# EAGLE design tact-switches2 (EAGLE 7.7.0)
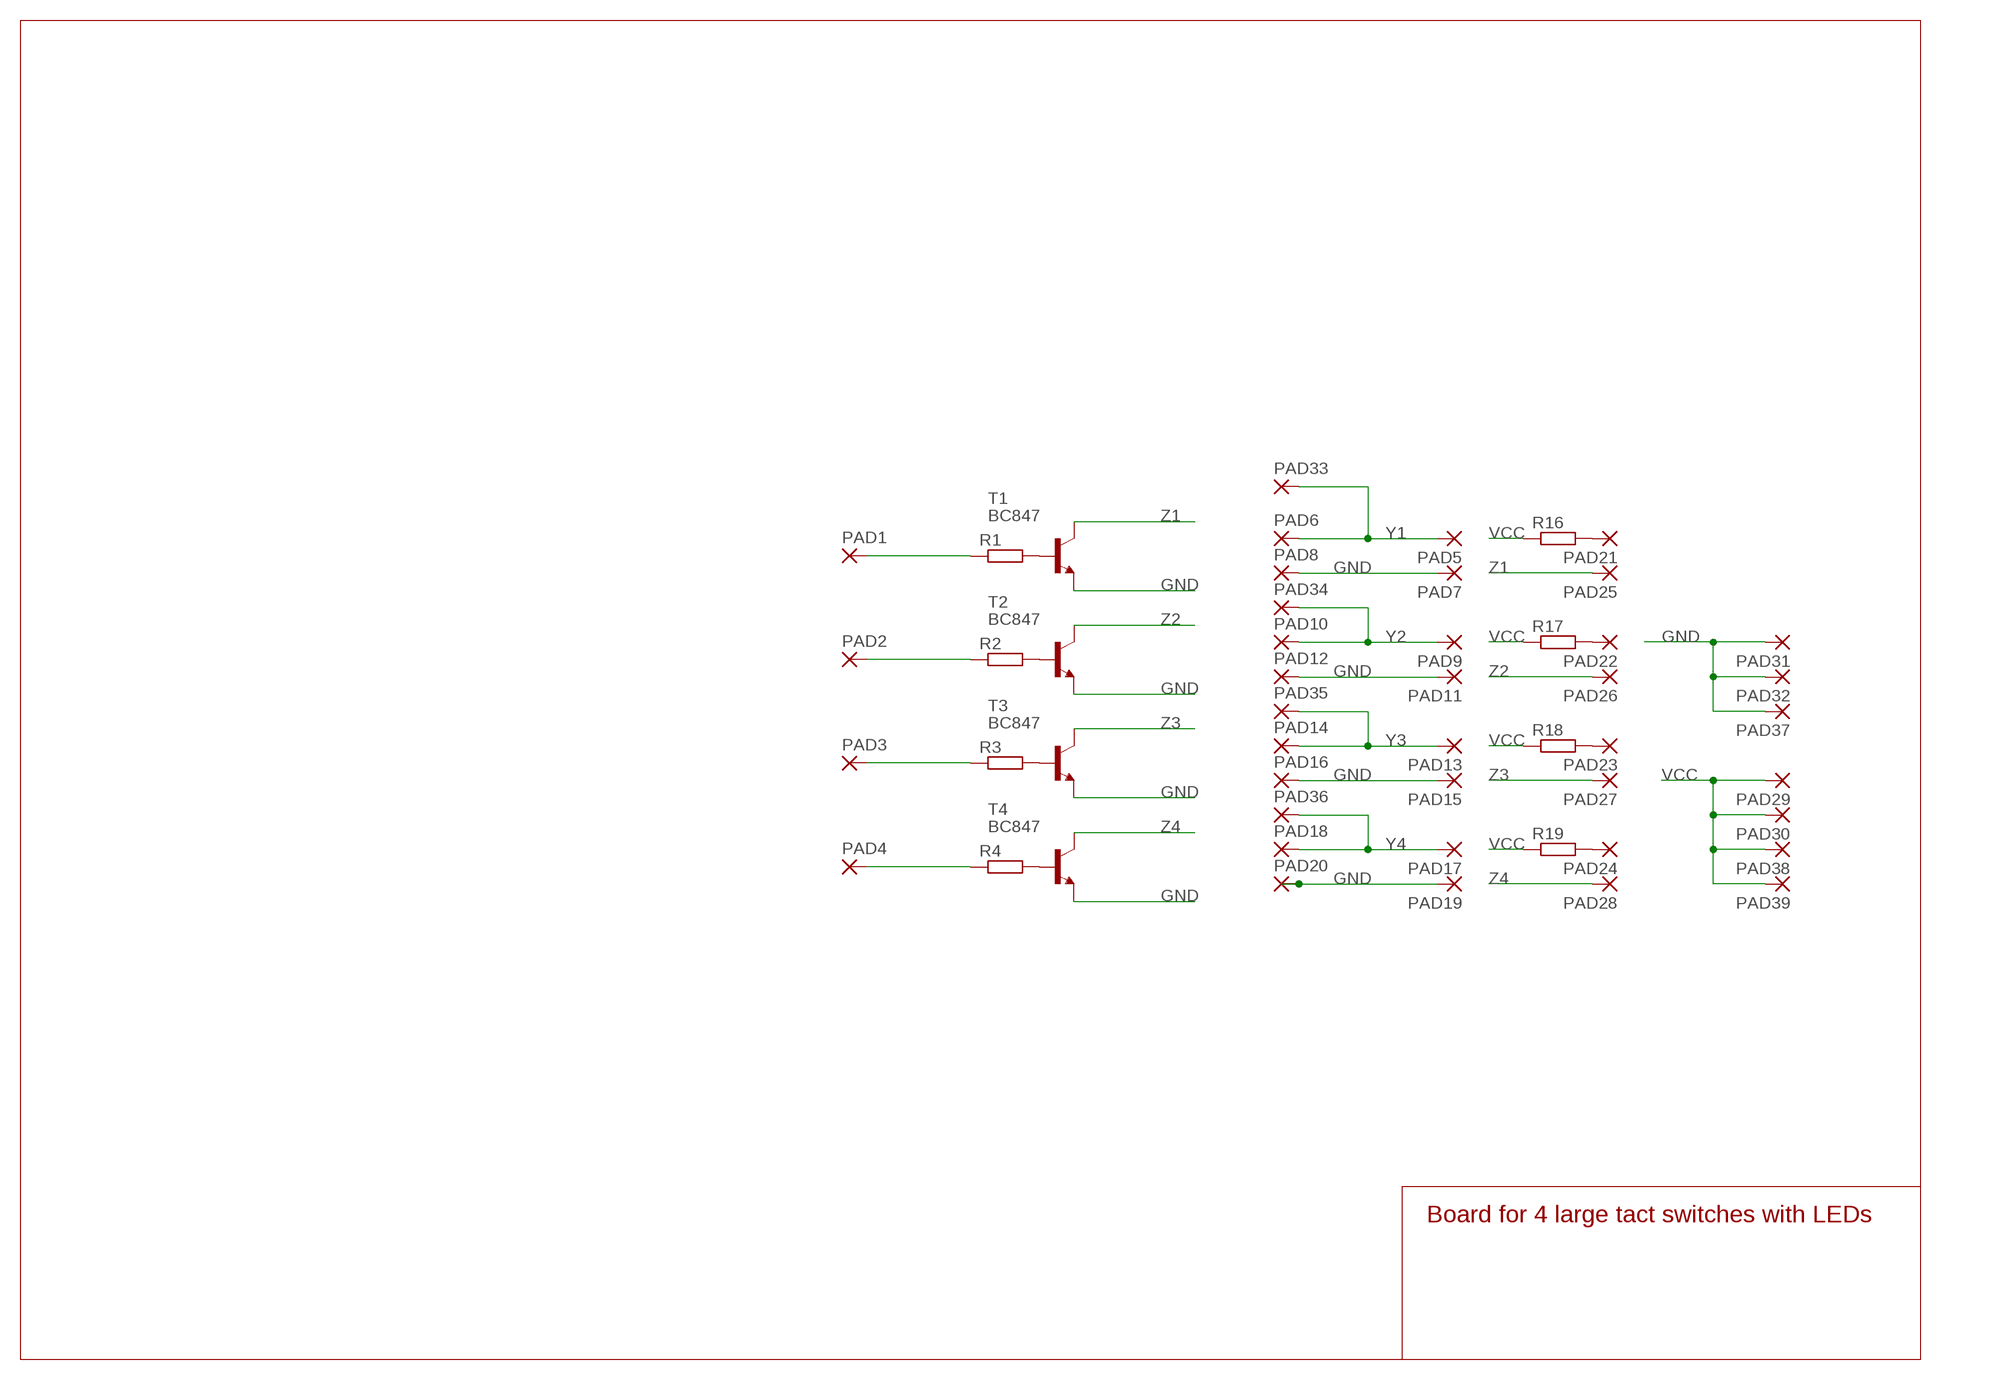
[diagram p0: schematic, sheet 1]

## Parts
PAD1  1,6/0,8  [1,6/0,8]
PAD2  1,6/0,8  [1,6/0,8]
PAD3  1,6/0,8  [1,6/0,8]
PAD4  1,6/0,8  [1,6/0,8]
PAD5  1,6/0,8  [1,6/0,8]
PAD6  1,6/0,8  [1,6/0,8]
PAD7  1,6/0,8  [1,6/0,8]
PAD8  1,6/0,8  [1,6/0,8]
PAD9  1,6/0,8  [1,6/0,8]
PAD10  1,6/0,8  [1,6/0,8]
PAD11  1,6/0,8  [1,6/0,8]
PAD12  1,6/0,8  [1,6/0,8]
PAD13  1,6/0,8  [1,6/0,8]
PAD14  1,6/0,8  [1,6/0,8]
PAD15  1,6/0,8  [1,6/0,8]
PAD16  1,6/0,8  [1,6/0,8]
PAD17  1,6/0,8  [1,6/0,8]
PAD18  1,6/0,8  [1,6/0,8]
PAD19  1,6/0,8  [1,6/0,8]
PAD20  1,6/0,8  [1,6/0,8]
PAD21  1,6/0,8  [1,6/0,8]
PAD22  1,6/0,8  [1,6/0,8]
PAD23  1,6/0,8  [1,6/0,8]
PAD24  1,6/0,8  [1,6/0,8]
PAD25  1,6/0,8  [1,6/0,8]
PAD26  1,6/0,8  [1,6/0,8]
PAD27  1,6/0,8  [1,6/0,8]
PAD28  1,6/0,8  [1,6/0,8]
PAD29  1,6/0,8  [1,6/0,8]
PAD30  1,6/0,8  [1,6/0,8]
PAD31  1,6/0,8  [1,6/0,8]
PAD32  1,6/0,8  [1,6/0,8]
PAD33  1,6/0,8  [1,6/0,8]
PAD34  1,6/0,8  [1,6/0,8]
PAD35  1,6/0,8  [1,6/0,8]
PAD36  1,6/0,8  [1,6/0,8]
PAD37  1,6/0,8  [1,6/0,8]
PAD38  1,6/0,8  [1,6/0,8]
PAD39  1,6/0,8  [1,6/0,8]
R1  R-EU_M0805  [M0805]
R2  R-EU_M0805  [M0805]
R3  R-EU_M0805  [M0805]
R4  R-EU_M0805  [M0805]
R16  R-EU_M0805  [M0805]
R17  R-EU_M0805  [M0805]
R18  R-EU_M0805  [M0805]
R19  R-EU_M0805  [M0805]
T1  BC847  [SOT23]
T2  BC847  [SOT23]
T3  BC847  [SOT23]
T4  BC847  [SOT23]

## Nets
GND: PAD7.1(P) PAD8.1(P) PAD11.1(P) PAD12.1(P) PAD15.1(P) PAD16.1(P) PAD19.1(P) PAD20.1(P) PAD31.1(P) PAD32.1(P) PAD37.1(P) T1.2(E) T2.2(E) T3.2(E) T4.2(E)
N$1: R1.2 T1.1(B)
N$2: R2.2 T2.1(B)
N$3: R3.2 T3.1(B)
N$4: R4.2 T4.1(B)
N$5: PAD1.1(P) R1.1
N$6: PAD2.1(P) R2.1
N$7: PAD3.1(P) R3.1
N$8: PAD4.1(P) R4.1
N$27: PAD21.1(P) R16.2
N$33: PAD22.1(P) R17.2
N$34: PAD23.1(P) R18.2
N$35: PAD24.1(P) R19.2
VCC: PAD29.1(P) PAD30.1(P) PAD38.1(P) PAD39.1(P) R16.1 R17.1 R18.1 R19.1
Y1: PAD5.1(P) PAD6.1(P) PAD33.1(P)
Y2: PAD9.1(P) PAD10.1(P) PAD34.1(P)
Y3: PAD13.1(P) PAD14.1(P) PAD35.1(P)
Y4: PAD17.1(P) PAD18.1(P) PAD36.1(P)
Z1: PAD25.1(P) T1.3(C)
Z2: PAD26.1(P) T2.3(C)
Z3: PAD27.1(P) T3.3(C)
Z4: PAD28.1(P) T4.3(C)

## Notes on the sheet
- Board for 4 large tact switches with LEDs

## Library data of the parts
PAD1-PAD39 = wirepad:1,6/0,8: THROUGH-HOLE PAD
R1-R4 R16-R19 = rcl:R-EU_: RESISTOR, European symbol
T1-T4 = transistor:BC847: NPN TRANSISTOR

## Board
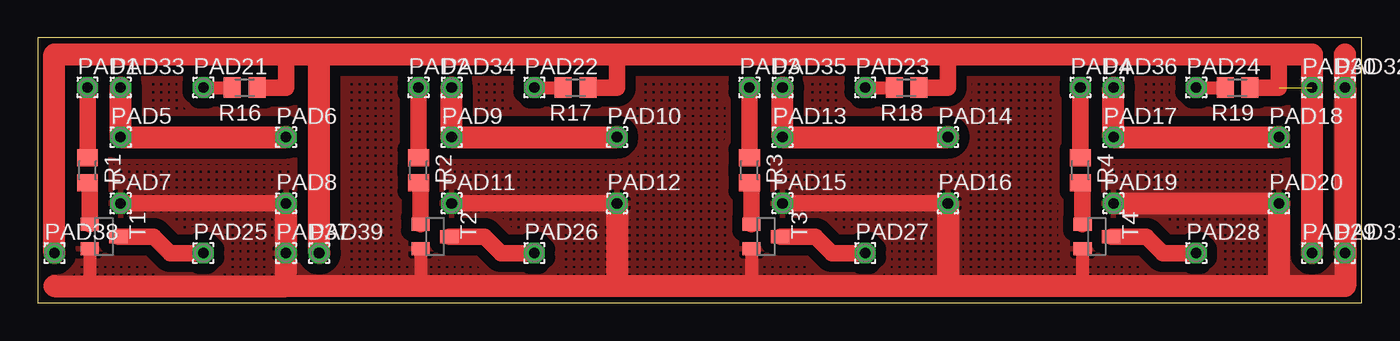
[diagram p1: board, top side]

Size 101.6 x 20.32 mm. Coordinates in mm from the lower left corner, seen from the top.
Outline: 0,0 101.6,0 101.6,20.32 0,20.32 0,0
Copper layers (1*16): Top 0.035mm / dielectric 1.5mm / Bottom 0.035mm
Design rules "default": minimum track width 10mil, minimum drill 24mil, track to track 8mil, track to pad 8mil, pad to pad 8mil, via to via 8mil, smd to smd 8mil, copper to edge 40mil, drill to drill 8mil, minimum pad ring 10mil, minimum via ring 8mil, stop-mask expansion 4mil, vias tented up to drill 0mil, thermal gap 10mil

### Footprints (pad centres in the part's own frame; a part is rotated, then mirrored left to right if it is on the bottom)
1,6/0,8 = drill 0.813 pad 1.6 octagon: 1 0,0
M0805 = smd 1.3 x 1.6: 1 -0.95,0; 2 0.95,0
SOT23 = smd 1 x 1.4: 1 -0.95,-1.1; 2 0.95,-1.1; 3 0,1.1

### Placement (x,y rotation side)
PAD1  3.81,16.51 0 top
PAD2  29.21,16.51 0 top
PAD3  54.61,16.51 0 top
PAD4  80.01,16.51 0 top
PAD5  6.35,12.7 0 top
PAD6  19.05,12.7 0 top
PAD7  6.35,7.62 0 top
PAD8  19.05,7.62 0 top
PAD9  31.75,12.7 0 top
PAD10  44.45,12.7 0 top
PAD11  31.75,7.62 0 top
PAD12  44.45,7.62 0 top
PAD13  57.15,12.7 0 top
PAD14  69.85,12.7 0 top
PAD15  57.15,7.62 0 top
PAD16  69.85,7.62 0 top
PAD17  82.55,12.7 0 top
PAD18  95.25,12.7 0 top
PAD19  82.55,7.62 0 top
PAD20  95.25,7.62 0 top
PAD21  12.7,16.51 0 top
PAD22  38.1,16.51 0 top
PAD23  63.5,16.51 0 top
PAD24  88.9,16.51 0 top
PAD25  12.7,3.81 0 top
PAD26  38.1,3.81 0 top
PAD27  63.5,3.81 0 top
PAD28  88.9,3.81 0 top
PAD29  97.79,3.81 0 top
PAD30  97.79,16.51 0 top
PAD31  100.33,3.81 0 top
PAD32  100.33,16.51 0 top
PAD33  6.35,16.51 0 top
PAD34  31.75,16.51 0 top
PAD35  57.15,16.51 0 top
PAD36  82.55,16.51 0 top
PAD37  19.05,3.81 0 top
PAD38  1.27,3.81 0 top
PAD39  21.59,3.81 0 top
R1  3.81,10.16 270 top
R2  29.21,10.16 270 top
R3  54.61,10.16 270 top
R4  80.01,10.16 270 top
R16  15.88,16.51 180 top
R17  41.27,16.51 180 top
R18  66.67,16.51 180 top
R19  92.08,16.51 180 top
T1  5.08,5.08 270 top
T2  30.48,5.08 270 top
T3  55.88,5.08 270 top
T4  81.28,5.08 270 top

### Tracks (layer width: path | path; a pad name or v marks a point on that pad's centre or on a via)
GND
  Top 1.016: T4.2 80.18,1.44 67.31,1.27 | T3.2 54.78,1.44 44.45,1.27 | T2.2 29.38,1.44 | T1.2 3.98,1.44 19.05,1.44
  Top 1.27: PAD7.1 PAD8.1 | PAD11.1 PAD12.1 | PAD15.1 PAD16.1
  Top 1.676: 95.25,1.27 100.33,1.27 PAD32.1 100.33,19.05 | 95.25,1.27 69.85,1.27 | 69.85,1.27 67.31,1.27 44.45,1.27 | 44.45,1.27 19.05,1.27 | PAD12.1 44.45,1.27 | PAD16.1 69.85,1.27 | 95.25,1.27 PAD20.1 PAD19.1 | 1.27,1.27 19.05,1.27 | 19.05,1.27 19.05,1.44 PAD37.1 PAD8.1
  pour Top (isolate 0.813, hatched): 0,0 101.6,0 101.6,20.32 0,20.32
N$1
  Top 1.27: R1.2 3.98,9.21 T1.1
N$2
  Top 1.27: R2.2 29.38,9.21 T2.1
N$3
  Top 1.27: R3.2 54.78,9.21 T3.1
N$4
  Top 1.27: R4.2 80.18,9.21 T4.1
N$5
  Top 1.27: PAD1.1 R1.1
N$6
  Top 1.27: R2.1 PAD2.1
N$7
  Top 1.27: R3.1 PAD3.1
N$8
  Top 1.27: R4.1 PAD4.1
N$27
  Top 1.016: PAD21.1 R16.2
N$33
  Top 1.016: PAD22.1 R17.2
N$34
  Top 1.016: PAD23.1 R18.2
N$35
  Top 1.016: PAD24.1 R19.2
VCC  (1 unrouted)
  Top 1.27: R19.1 95.25,16.51 95.25,19.05 | R18.1 69.85,16.51 69.85,19.05 | R17.1 44.45,16.51 44.45,19.05 | R16.1 19.05,16.51 19.05,19.05
  Top 1.676: 21.59,19.05 19.05,19.05 1.27,19.05 PAD38.1 | 21.59,19.05 44.45,19.05 69.85,19.05 95.25,19.05 97.79,19.05 PAD29.1 | PAD39.1 21.59,19.05
Y1
  Top 1.676: PAD6.1 PAD5.1 PAD33.1
Y2
  Top 1.676: PAD10.1 PAD9.1 PAD34.1
Y3
  Top 1.676: PAD14.1 PAD13.1 PAD35.1
Y4
  Top 1.676: PAD18.1 PAD17.1 PAD36.1
Z1
  Top 1.27: T1.3 8.89,5.08 10.16,3.81 PAD25.1
Z2
  Top 1.27: T2.3 34.29,5.08 35.56,3.81 PAD26.1
Z3
  Top 1.27: T3.3 59.69,5.08 60.96,3.81 PAD27.1
Z4
  Top 1.27: T4.3 85.09,5.08 86.36,3.81 PAD28.1